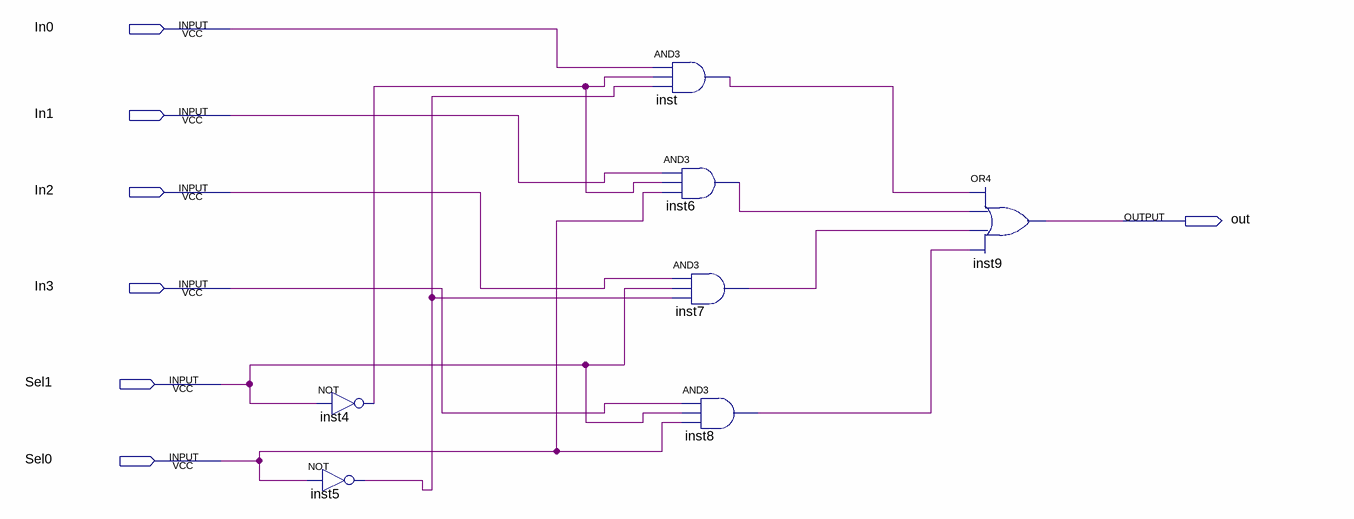
[diagram p0: schematic sheet]
// Quartus schematic mux4x1_1bit.bdf as structural Verilog: 7 symbols, 7 pins
module mux4x1_1bit (
  input  In0,
  input  In1,
  input  In2,
  input  In3,
  input  Sel1,
  input  Sel0,
  output out
);

  wire inst4_out, inst5_out, inst6_out, inst7_out, inst8_out, inst_out;

  not inst4 (inst4_out, Sel1);
  not inst5 (inst5_out, Sel0);
  and inst (inst_out, In0, inst4_out, inst5_out);
  and inst6 (inst6_out, In1, inst4_out, Sel0);
  and inst7 (inst7_out, In2, Sel1, inst5_out);
  and inst8 (inst8_out, In3, Sel1, Sel0);
  or inst9 (out, inst_out, inst6_out, inst7_out, inst8_out);
endmodule
